# EAGLE design Qtouch (EAGLE 5.12)
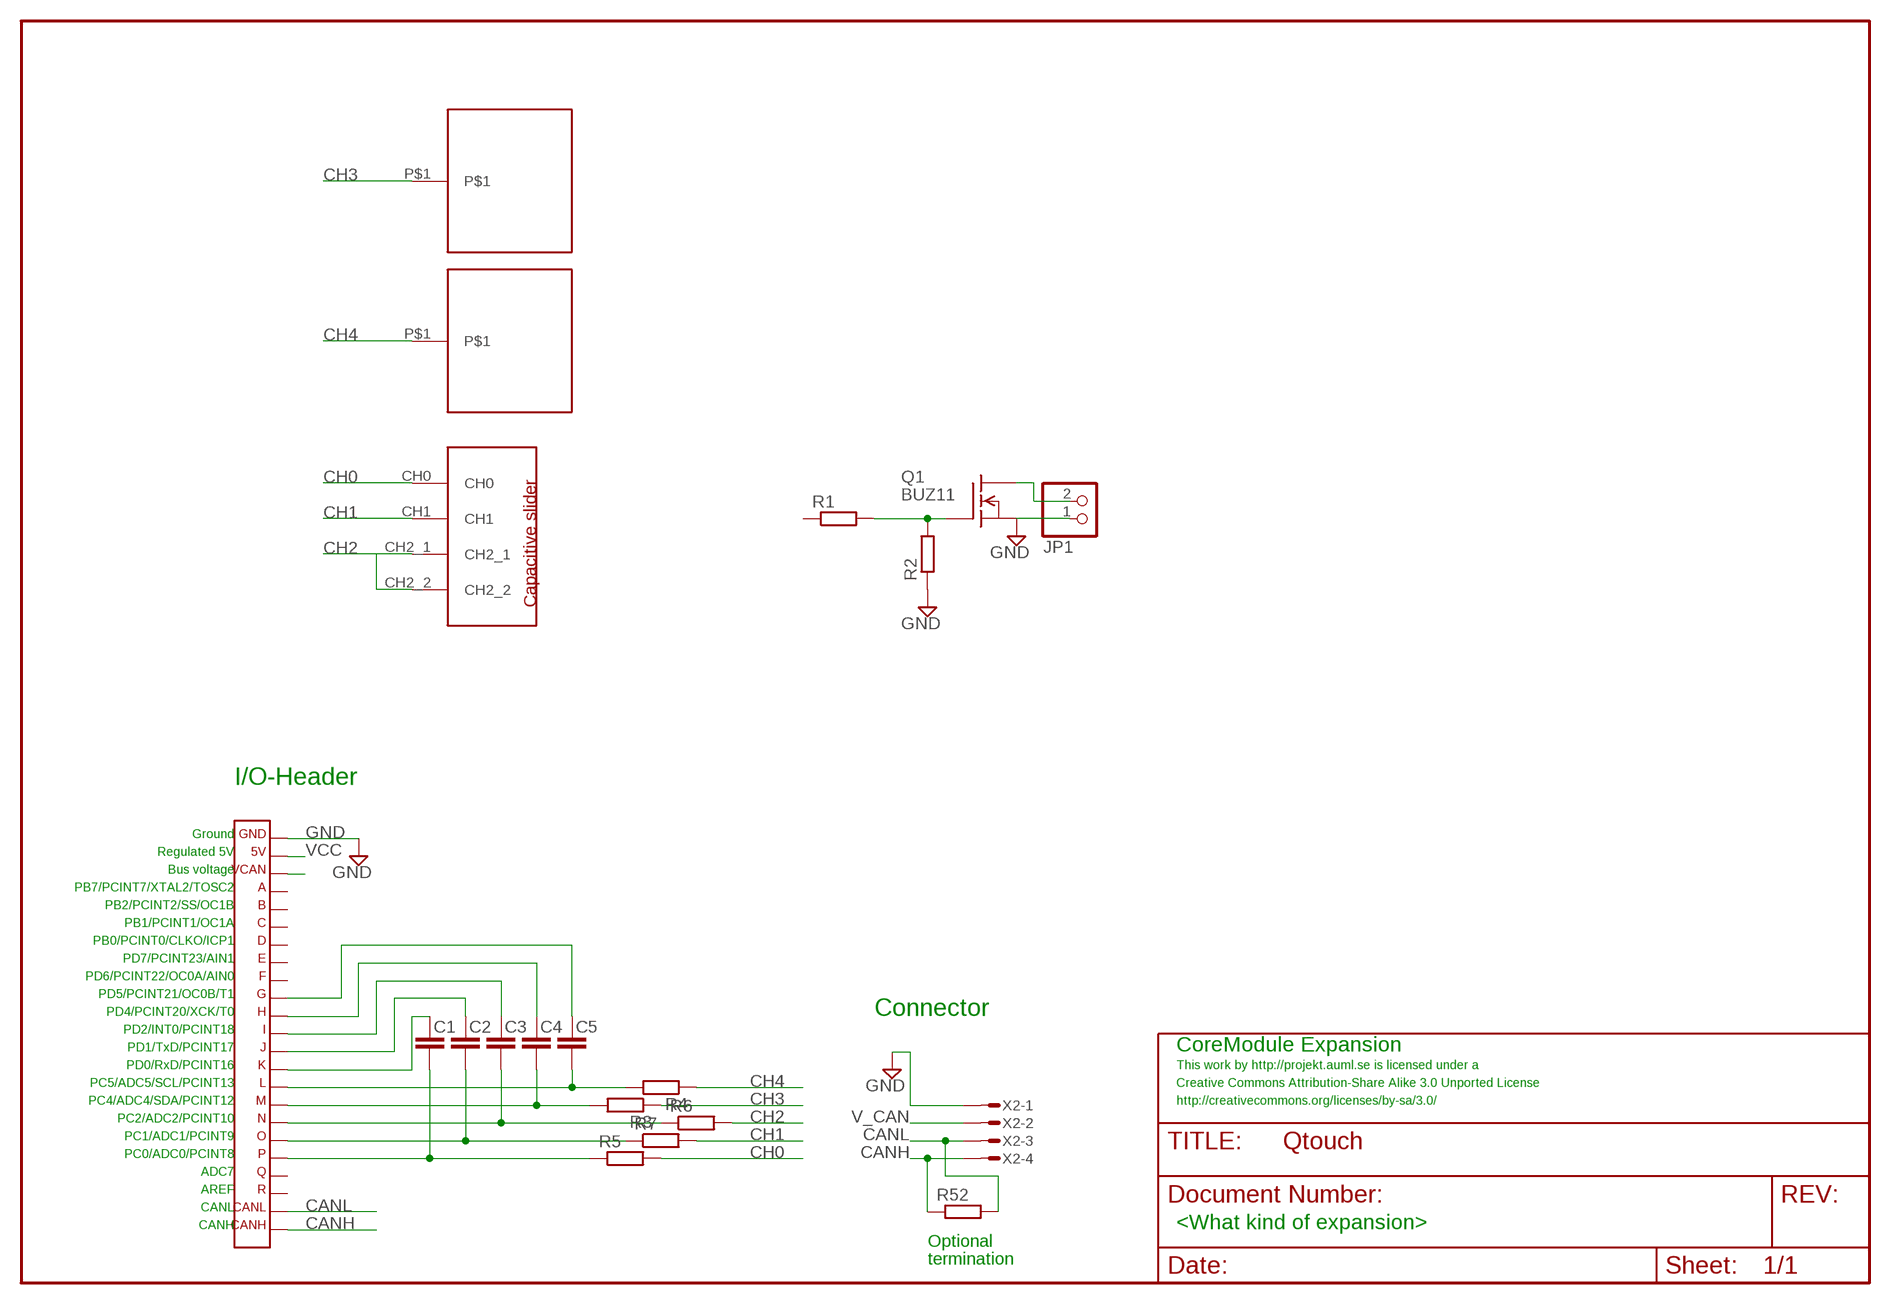
[diagram p0: schematic, sheet 1]

## Parts
C1  C-EUC0603  [C0603]
C2  C-EUC0603  [C0603]
C3  C-EUC0603  [C0603]
C4  C-EUC0603  [C0603]
C5  C-EUC0603  [C0603]
JP1  PINHD-1X2/90  [1X02/90]
Q1  BUZ11  [TO220]
R1  R-EUR0603  [R0603]
R2  R-EUR0603  [R0603]
R3  R-EUR0603  [R0603]
R4  R-EUR0603  [R0603]
R5  R-EUR0603  [R0603]
R6  R-EUR0603  [R0603]
R7  R-EUR0603  [R0603]
R52  R-EUR0603  [R0603]
U$1  SLIDER  [SLIDER_6MM_50MM]
U$2  BUTTON  [BUTTON_12X12MM]
U$3  BUTTON  [BUTTON_12X12MM]
X1  CORETWO_LAYOUTISPHOLES_CU  [CORETWO_LAYOUT_ISPHOLES_CU]
X2  MICROMATCH-4  [MICROMATCH-4]

## Nets
CANH: R52.1 X1.CANH X2.4
CANL: R52.2 X1.CANL X2.3
CH0: R5.2 U$1.CH0
CH1: R7.2 U$1.CH1
CH2: R6.2 U$1.CH2_1 U$1.CH2_2
CH3: R3.1 U$3.P$1
CH4: R4.1 U$2.P$1
EXP_L: C5.2 R4.2 X1.L
EXP_M: C4.2 R3.2 X1.M
EXP_N: C3.2 R6.1 X1.N
EXP_O: C2.2 R7.1 X1.O
EXP_P: C1.2 R5.1 X1.P
GND: JP1.1 Q1.3(S) R2.1 X1.GND X2.1
N$1: Q1.1(G) R1.2 R2.2
N$2: C1.1 X1.K
N$3: C2.1 X1.J
N$4: C3.1 X1.I
N$5: C4.1 X1.H
N$6: C5.1 X1.G
N$7: JP1.2 Q1.2(D)
V_CAN: X1.VCAN X2.2
VCC: X1.5V
Unconnected: R1.1 X1.A X1.B X1.C X1.D X1.E X1.F X1.Q X1.R

## Notes on the sheet
- I/O-Header
- Ground
- Regulated 5V
- Bus voltage
- PB7/PCINT7/XTAL2/TOSC2
- PB2/PCINT2/SS/OC1B
- PB1/PCINT1/OC1A
- PB0/PCINT0/CLKO/ICP1
- PD7/PCINT23/AIN1
- PD6/PCINT22/OC0A/AIN0
- PD5/PCINT21/OC0B/T1
- PD4/PCINT20/XCK/T0 | Connector
- PD2/INT0/PCINT18
- PD1/TxD/PCINT17 | CoreModule Expansion
- PD0/RxD/PCINT16 | This work by http://projekt.auml.se is licensed under a
- PC5/ADC5/SCL/PCINT13 | Creative Commons Attribution-Share Alike 3.0 Unported License
- PC4/ADC4/SDA/PCINT12 | http://creativecommons.org/licenses/by-sa/3.0/
- PC2/ADC2/PCINT10
- PC1/ADC1/PCINT9
- PC0/ADC0/PCINT8
- ADC7
- AREF
- CANL
- CANH | <What kind of expansion>
- Optional
- termination

## Library data of the parts
C1-C5 = rcl:C-EU
JP1 = pinhead:PINHD-1X2: PIN HEADER
Q1 = transistor-fet:BUZ11: N-Channel Enhancement MOSFET 50V; 30A; 0,040Ohm
R1-R7 R52 = rcl:R-EU
U$1 = qtouch:SLIDER
U$2 U$3 = qtouch:BUTTON
X1 = expboard:CORETWO_LAYOUT
X2 = con-amp-micromatch:MICROMATCH-4: MicroMaTch 4 7-215464-4 / 0-215464-4 Drawing Number C-215464 DDEController.pdf

## Board
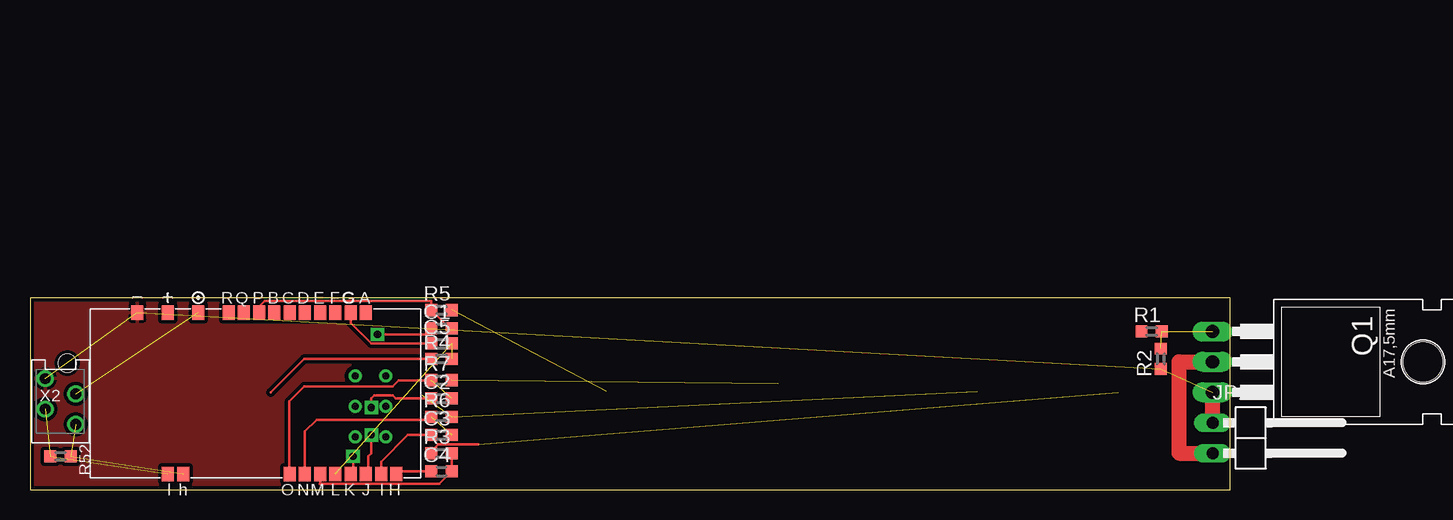
[diagram p1: board, top side]
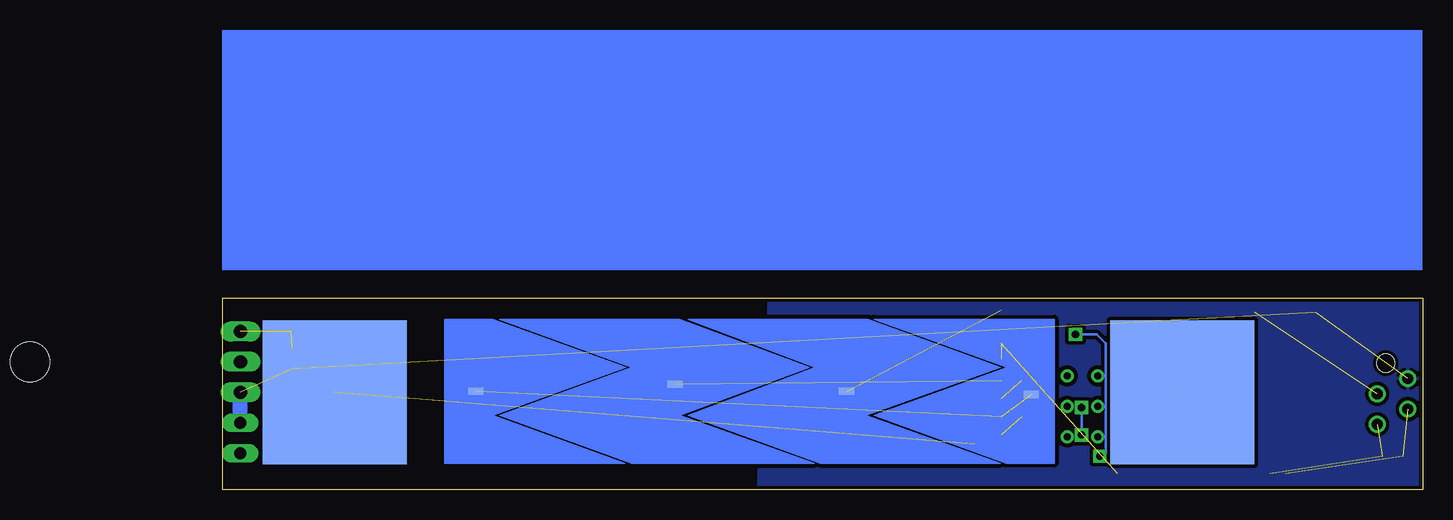
[diagram p2: board, bottom side, seen from below]

Size 100 x 16 mm. Coordinates in mm from the lower left corner, seen from the top.
Outline: 0,0 100,0 100,16 0,16 0,0
Copper layers (1*16): Top 0.035mm / dielectric 1.5mm / Bottom 0.035mm
Design rules "default": minimum track width 10mil, minimum drill 0.4mm, track to track 10mil, track to pad 10mil, pad to pad 10mil, via to via 10mil, smd to smd 8mil, copper to edge 10mil, drill to drill 8mil, minimum pad ring 10mil, minimum via ring 10mil, stop-mask expansion 4mil, vias tented up to drill 18mil, thermal gap 10mil

### Footprints (pad centres in the part's own frame; a part is rotated, then mirrored left to right if it is on the bottom)
C0603 = smd 1 x 1: 1 -0.85,0; 2 0.85,0
1X02/90 = drill 1.016 long: 1 -1.27,-3.81; 2 1.27,-3.81
TO220 = drill 1.118 long: 1 -2.54,-6.35; 2 0,-6.35; 3 2.54,-6.35 | hole 3.302: 0,11.176
R0603 = smd 0.991 x 1.016: 1 -0.85,0; 2 0.85,0
SLIDER_6MM_50MM = smd 1.27 x 0.635: CH0 17.3,6; CH1 31.6,5.4; CH2_1 1.9,6.3; CH2_2 48.2,6
BUTTON_12X12MM = smd 12 x 12: P$1 0,0
CORETWO_LAYOUT_ISPHOLES_CU = smd 1 x 1.2: 5V 7.315,-6.648; A -9.195,-6.648; B -1.575,-6.648; C -2.845,-6.648; CANH 6.045,6.814; CANL 7.315,6.814; D -4.115,-6.648; E -5.385,-6.648; F -6.655,-6.648; G -7.925,-6.648; GND 9.855,-6.648; H -11.735,6.814; I -10.465,6.814; J -9.195,6.814; K -7.925,6.814; L -6.655,6.814; M -5.385,6.814; N -4.115,6.814; O -2.845,6.814; P -0.305,-6.648; Q 0.965,-6.648; R 2.235,-6.648; VCAN 4.775,-6.648 | drill 0.6 round: P$1 -10.846,3.708; P$2 -8.306,3.708; P$3 -10.846,1.168; P$4 -8.306,1.168; P$5 -8.306,-1.372; P$6 -10.846,-1.372
MICROMATCH-4 = drill 0.9 round: 1 1.905,1.27; 2 0.635,-1.27; 3 -0.635,1.27; 4 -1.905,-1.27 | hole 1.5: 3.199,-0.562

### Placement (x,y rotation side)
C1  34.29,13.46 0 top
C2  34.29,7.62 0 top
C3  34.29,4.57 0 top
C4  34.29,1.52 0 top
C5  34.29,12.19 0 top
JP1  102.36,4.32 270 top
Q1  104.9,10.67 270 top
R1  93.47,13.21 0 top
R2  94.23,10.92 90 top
R3  34.29,3.05 0 top
R4  34.29,10.92 0 top
R5  34.29,14.99 0 top
R6  34.29,6.1 0 top
R7  34.29,9.14 0 top
R52  2.54,2.79 180 top
U$1  30.73,14.22 180 bottom
U$2  20.07,8.13 0 bottom
U$3  90.68,8.13 0 bottom
X1  18.8,8.13 180 top
X2  2.54,7.37 90 top

### Tracks (layer width: path | path; a pad name or v marks a point on that pad's centre or on a via)
CANH  (2 unrouted)
CANL  (2 unrouted)
CH0  (1 unrouted)
CH1  (1 unrouted)
CH2  (2 unrouted)
CH3  (1 unrouted)
  Top 0.2: R3.1 33.44,3.21 34.04,3.81 37.34,3.81
CH4  (1 unrouted)
  Top 0.2: R4.1 22.86,10.92 U$2.P$1
EXP_L  (2 unrouted)
EXP_M
  Top 0.2: X1.M 24.18,0.56 24.13,0.51 34.12,0.51 C4.2 R3.2
EXP_N  (1 unrouted)
  Top 0.2: X1.N 22.91,4.88 23.88,5.84 33.19,5.84 R6.1
EXP_O  (1 unrouted)
  Top 0.2: R7.1 30.73,9.14 30.23,8.64 22.86,8.64 21.59,7.37 21.59,1.36 X1.O
EXP_P
  Top 0.2: X1.P 19.1,15.29 19.56,15.75 33.44,15.75 R5.1 34.96,13.46 C1.2
GND  (3 unrouted)
  Top 1.27: JP1.1 Q1.3
  Bottom 1.27: JP1.1 Q1.3
  pour Bottom (isolate 0.305, rank 3): 0,34.92 53.34,34.92 55.37,0 0,0
  pour Top (isolate 0.305, rank 3): 0,34.92 53.34,34.92 53.34,0 0,0
N$1  (2 unrouted)
N$2  (via drill 0.6)
  Top 0.2: C1.1 32.93,12.95 v28.96,12.95 | v26.92,2.79 26.92,1.52 X1.K
  Bottom 0.2: v28.96,12.95 27.18,12.95 26.42,12.19 26.42,3.05 26.67,2.79 v26.92,2.79
N$3  (via drill 0.6)
  Top 0.2: C2.1 30.48,7.62 30.23,7.87 28.7,7.87 28.45,7.62 v28.45,6.86 | v28.45,4.57 28.45,3.05 28.19,2.79 28.19,1.52 X1.J
  Bottom 0.2: v28.45,4.57 v28.45,6.86
N$4
  Top 0.2: X1.I 29.26,2.34 31.5,4.57 C3.1
N$5
  Top 0.2: X1.H 30.53,1.52 C4.1
N$6
  Top 0.2: X1.G 26.72,13.92 28.45,12.19 C5.1
N$7
  Top 1.27: JP1.2 95.76,3.05 95.76,10.67 Q1.2
V_CAN  (1 unrouted)
(copper drawn outside any net)
  shapes: Bottom area x1

### Text on the board
Document: Creative Commons Attribution-Share Alike 3.0 Unported License | This work by http://projekt.auml.se is licensed under a | http://creativecommons.org/licenses/by-sa/3.0/